# EAGLE design C64_Userport_Test_SMD (EAGLE 9.6.2)
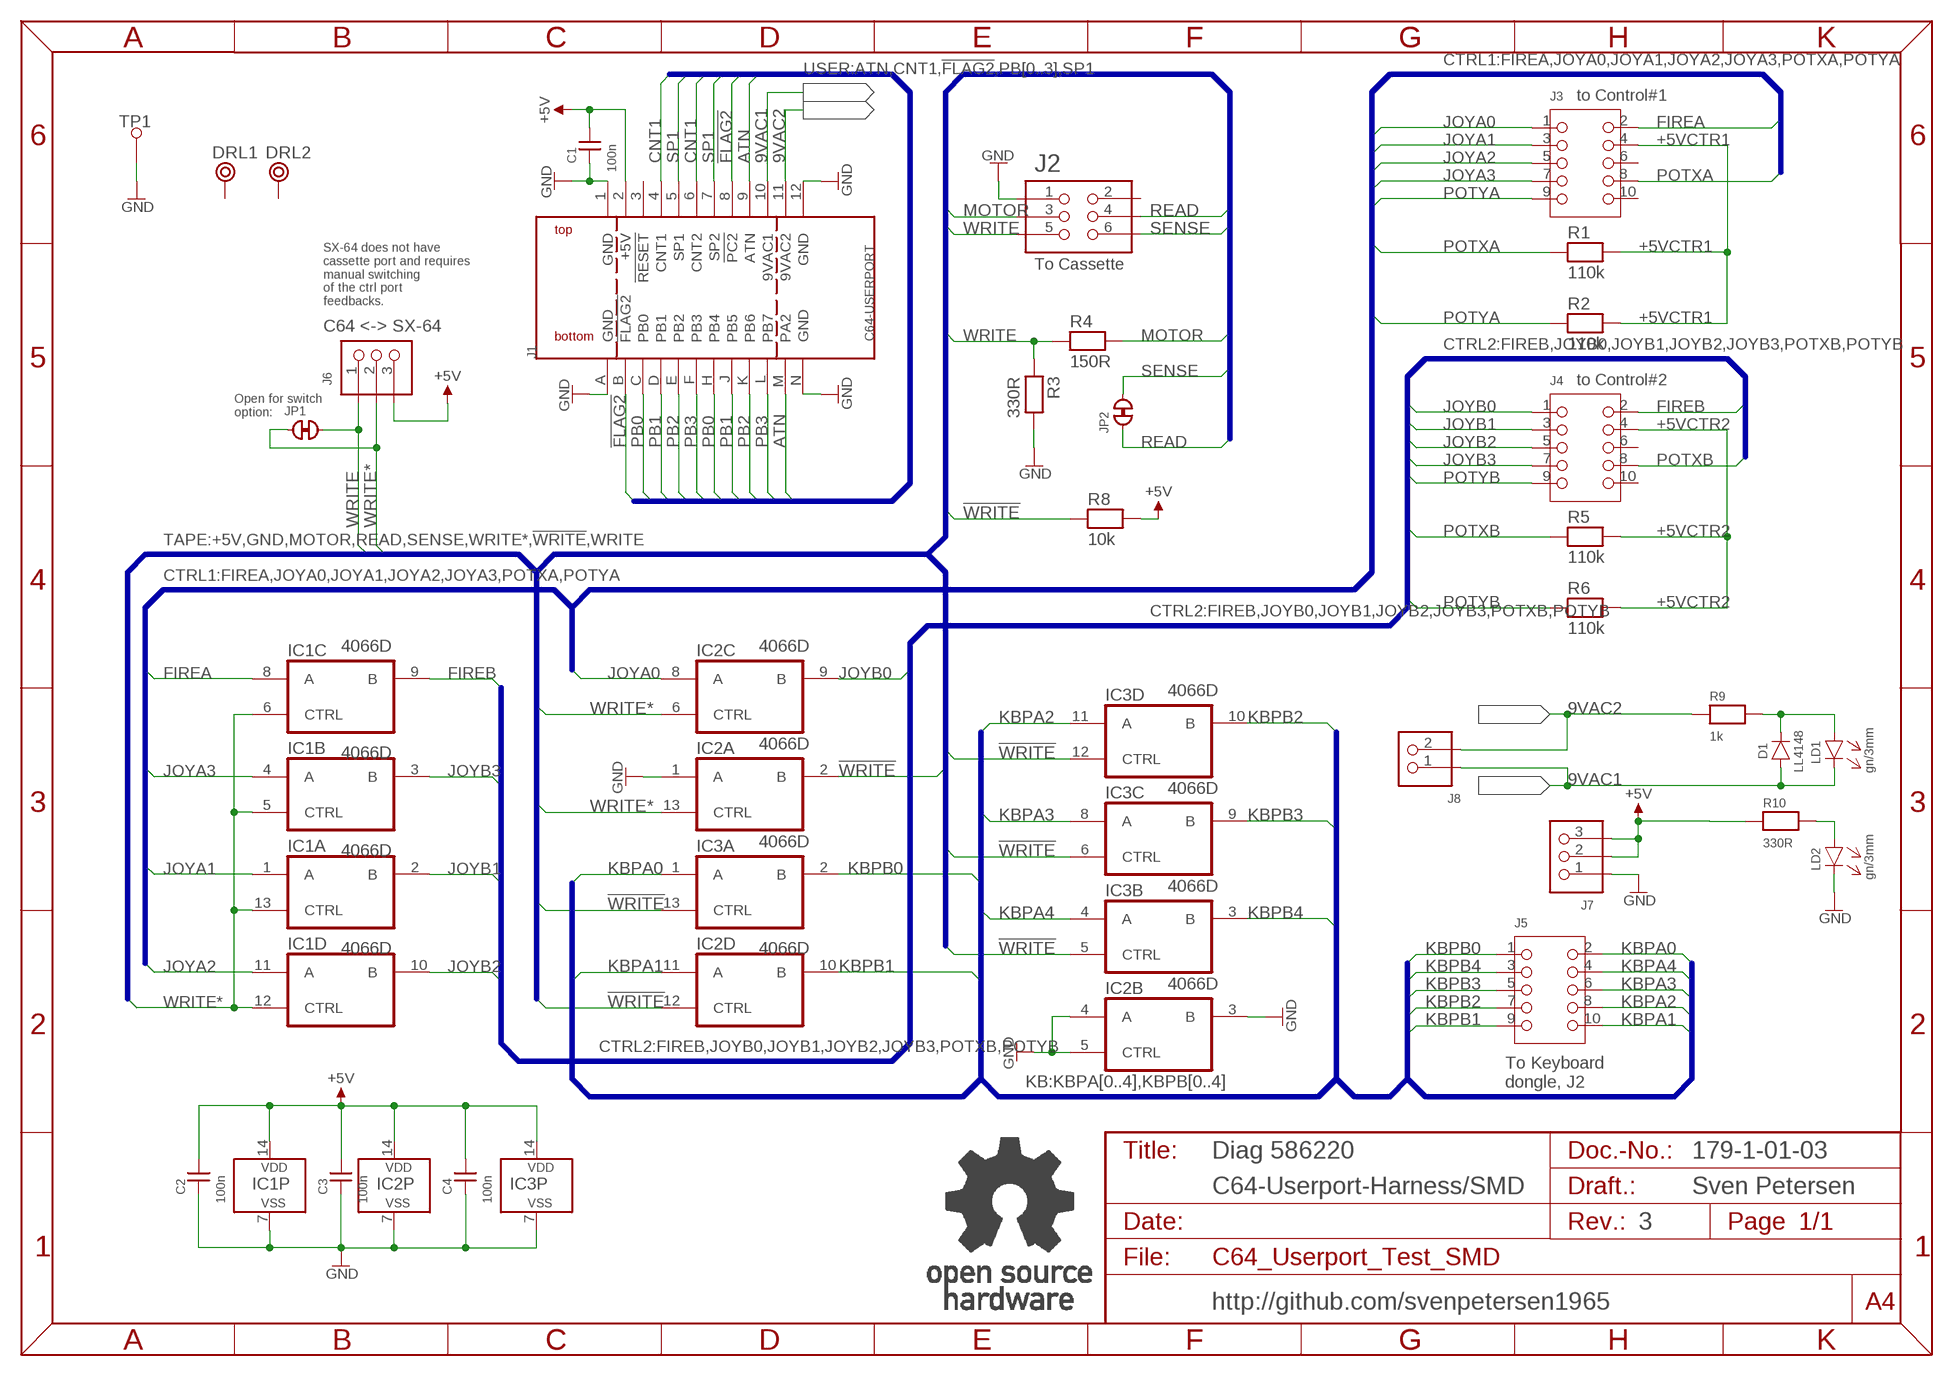
[diagram p0: schematic, sheet 1]

## Parts
C1  100n  CAP010805  [0805]
C2  100n  CAP010805  [0805]
C3  100n  CAP010805  [0805]
C4  100n  CAP010805  [0805]
D1  LL4148  [SOD80C]
DRL1  BOHR3,2  [BOHR3,2]
DRL2  BOHR3,2  [BOHR3,2]
IC1  4066D  [SO14]
IC2  4066D  [SO14]
IC3  4066D  [SO14]
J1  C64-USERPORT  [USERPORT]
J2  2X03WV  [2X03WV]
J3  2X05WV  [2X05WV]
J4  2X05WV  [2X05WV]
J5  2X05WV  [2X05WV]
J6  PINHD-1X3  [1X03]
J7  PINHD-1X3  [1X03]
J8  PINHD-1X2  [1X02]
JP1  CLOSED  [CP_CL]
JP2  CLOSED  [CP_CL]
LD1  gn/3mm  3MM  [3MM]
LD2  gn/3mm  3MM  [3MM]
R1  110k  RES040805  [0805]
R2  110k  RES040805  [0805]
R3  330R  RES040805  [0805]
R4  150R  RES040805  [0805]
R5  110k  RES040805  [0805]
R6  110k  RES040805  [0805]
R8  10k  RES040805  [0805]
R9  1k  RES040805  [0805]
R10  330R  RES040805  [0805]
TP1  L1,2_R  [1,2MM_R]
U$20  OPEN_SOURCE_HW  [OPENHW]

## Nets
9VAC1: D1.A J1.10(9VAC1) J8.1 LD1.C(K)
9VAC2: J1.11(9VAC2) J8.2 R9.1
!FLAG2: J1.8(!PC2) J1.B(!FLAG2)
!WRITE: IC2.2(A:B) IC2.12(D:CTRL) IC3.5(B:CTRL) IC3.6(C:CTRL) IC3.12(D:CTRL) IC3.13(A:CTRL) R8.1
+5V: C1.2 C2.2 C3.2 C4.2 IC1.14(P:VDD) IC2.14(P:VDD) IC3.14(P:VDD) J1.2(+5V) J6.3 J7.2 J7.3 R8.2 R10.1
+5VCTR1: J3.4 R1.2 R2.2
+5VCTR2: J4.4 R5.2 R6.2
ATN: J1.9(ATN) J1.M(PA2)
CNT1: J1.4(CNT1) J1.6(CNT2)
FIREA: IC1.8(C:A) J3.2
FIREB: IC1.9(C:B) J4.2
GND: C1.1 C2.1 C3.1 C4.1 IC1.7(P:VSS) IC2.1(A:A) IC2.3(B:B) IC2.4(B:A) IC2.5(B:CTRL) IC2.7(P:VSS) IC3.7(P:VSS) J1.1(GND) J1.12(GND) J1.A(GND) J1.N(GND) J2.1 J7.1 LD2.C(K) R3.2 TP1.1
JOYA0: IC2.8(C:A) J3.1
JOYA1: IC1.1(A:A) J3.3
JOYA2: IC1.11(D:A) J3.5
JOYA3: IC1.4(B:A) J3.7
JOYB0: IC2.9(C:B) J4.1
JOYB1: IC1.2(A:B) J4.3
JOYB2: IC1.10(D:B) J4.5
JOYB3: IC1.3(B:B) J4.7
KBPA0: IC3.1(A:A) J5.2
KBPA1: IC2.11(D:A) J5.10
KBPA2: IC3.11(D:A) J5.8
KBPA3: IC3.8(C:A) J5.6
KBPA4: IC3.4(B:A) J5.4
KBPB0: IC3.2(A:B) J5.1
KBPB1: IC2.10(D:B) J5.9
KBPB2: IC3.10(D:B) J5.7
KBPB3: IC3.9(C:B) J5.5
KBPB4: IC3.3(B:B) J5.3
MOTOR: J2.3 R4.2
N$1: D1.K LD1.A R9.2
N$3: LD2.A R10.2
PB0: J1.C(PB0) J1.H(PB4)
PB1: J1.D(PB1) J1.J(PB5)
PB2: J1.E(PB2) J1.K(PB6)
PB3: J1.F(PB3) J1.L(PB7)
POTXA: J3.8 R1.1
POTXB: J4.8 R5.1
POTYA: J3.9 R2.1
POTYB: J4.9 R6.1
READ: J2.4 JP2.1
SENSE: J2.6 JP2.2
SP1: J1.5(SP1) J1.7(SP2)
WRITE: J2.5 J6.1 JP1.2 R3.1 R4.1
WRITE*: IC1.5(B:CTRL) IC1.6(C:CTRL) IC1.12(D:CTRL) IC1.13(A:CTRL) IC2.6(C:CTRL) IC2.13(A:CTRL) J6.2 JP1.1
Unconnected: DRL1.P$1 DRL2.P$1 J1.3(!RESET) J2.2 J3.6 J3.10 J4.6 J4.10

## Buses
USER:ATN,CNT1,!FLAG2,PB[0..3],SP1
TAPE:+5V,GND,MOTOR,READ,SENSE,WRITE*,!WRITE,WRITE
CTRL1:FIREA,JOYA0,JOYA1,JOYA2,JOYA3,POTXA,POTYA
CTRL2:FIREB,JOYB0,JOYB1,JOYB2,JOYB3,POTXB,POTYB
KB:KBPA[0..4],KBPB[0..4]

## Notes on the sheet
- to Control#1
- To Cassette
- SX-64 does not have
  cassette port and requires
  manual switching
  of the ctrl port
  feedbacks.
- C64 <-> SX-64
- to Control#2
- Open for switch
  option:
- To Keyboard
  dongle, J2
- Diag 586220 | 179-1-01-03
- C64-Userport-Harness/SMD | Sven Petersen
- 3
- http://github.com/svenpetersen1965

## Library data of the parts
C1-C4 = DISCRETE:CAP01
D1 = Dioden:LL4148
DRL1 DRL2 = Mech_Bohr:BOHR3,2
IC1-IC3 = 40xx:4066: Quad bilateral ANALOG SWITCH
J1 = Commodore:C64-USERPORT
J2 = PINHEAD:2X03WV
J3-J5 = PINHEAD:2X05WV
J6 J7 = PINHEAD:PINHD-1X3
J8 = PINHEAD:PINHD-1X2
JP1 JP2 = Cutpad:CLOSED: Closed Cutpad
LD1 LD2 = LED:3MM
R1-R6 R8-R10 = DISCRETE:RES04
TP1 = Pads:L1,2_R
U$20 = Logo:OPEN_SOURCE_HW

## Board
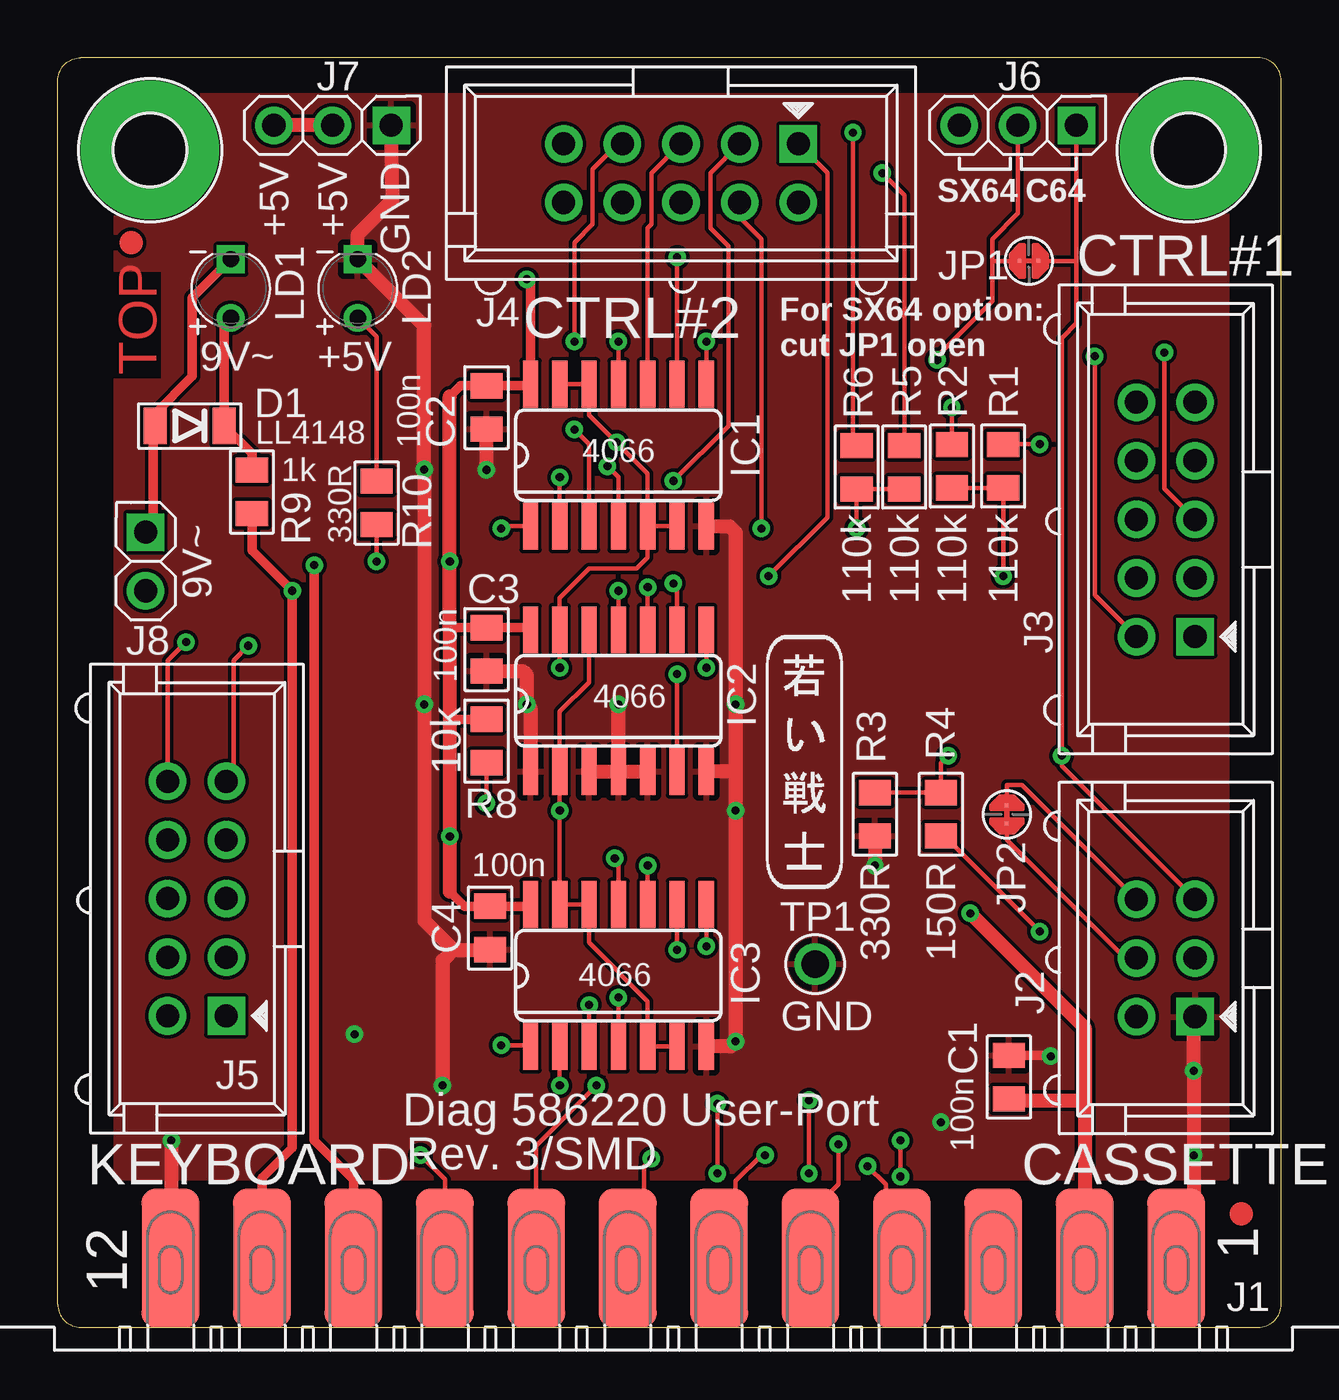
[diagram p1: board, top side]
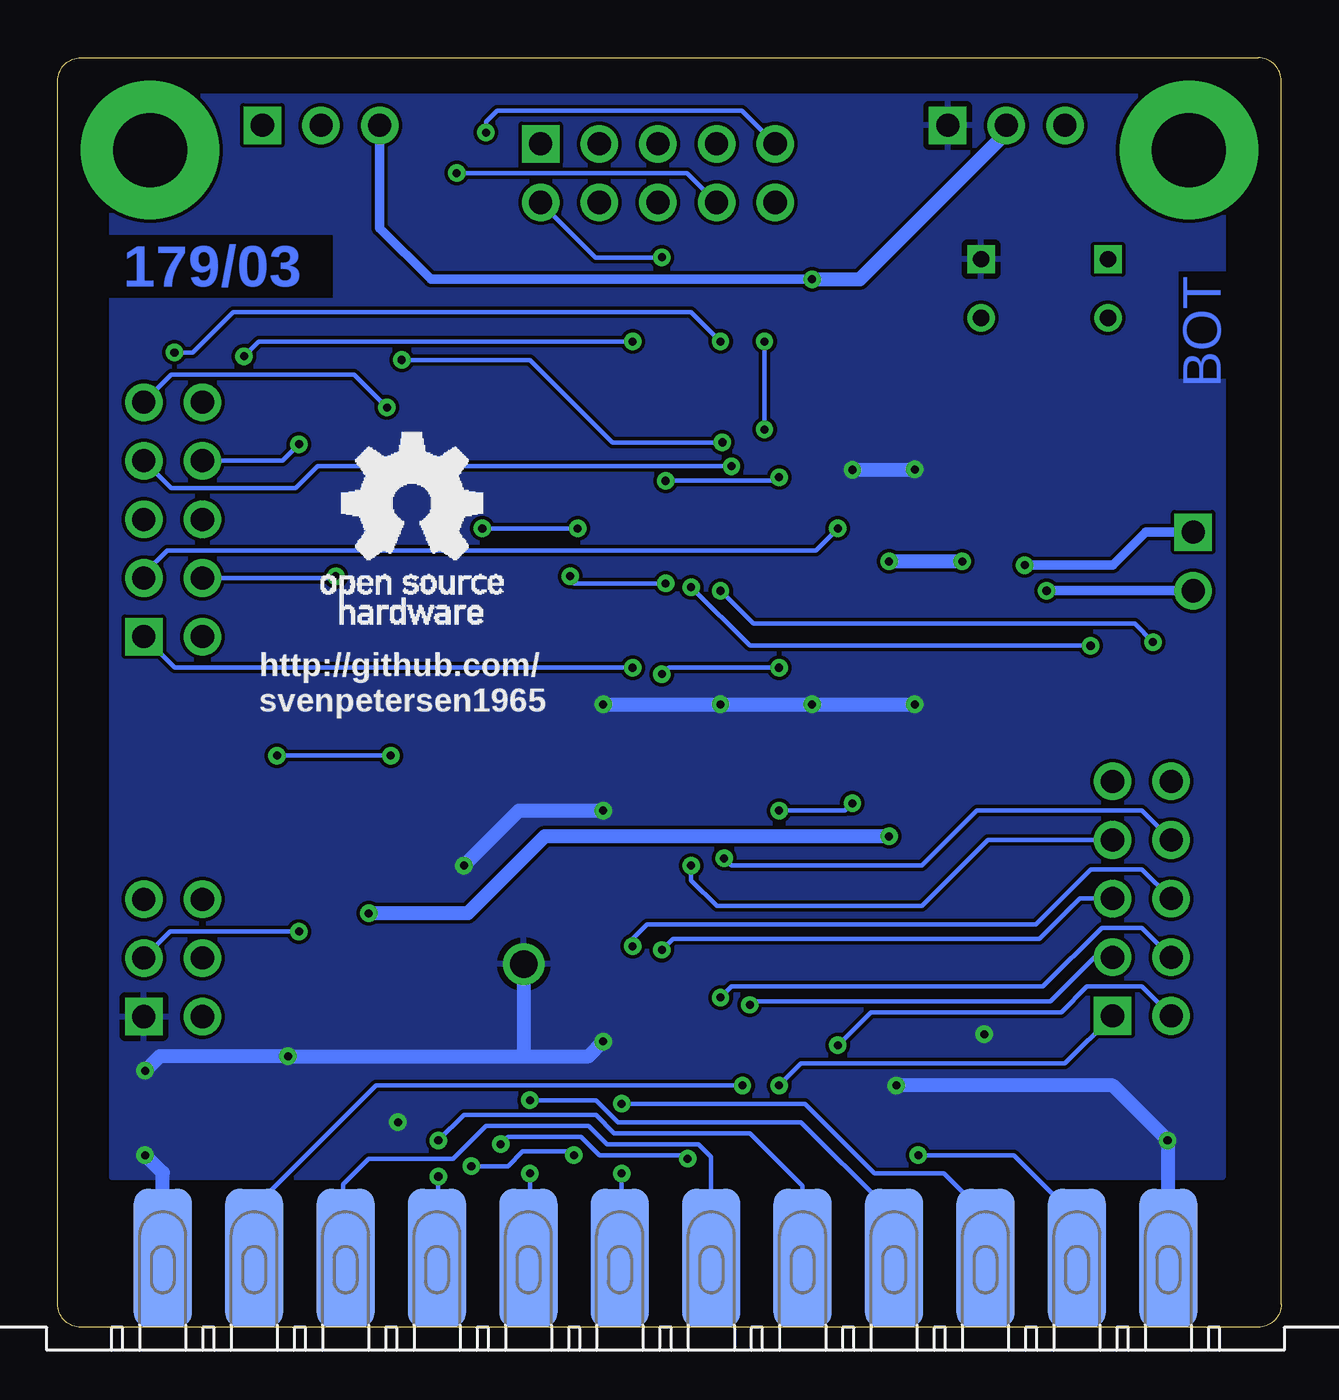
[diagram p2: board, bottom side, seen from below]

Size 53 x 55 mm. Coordinates in mm from the lower left corner, seen from the top.
Outline: 0,1 0,54 arc-90 1,55 52,55 arc-90 53,54 53,1 arc-90 52,0 1,0 arc-90 0,1
Copper layers (1*16): Top 0.035mm / dielectric 1.5mm / Bottom 0.035mm
Design rules "default *": minimum track width 6mil, minimum drill 0.35mm, track to track 6mil, track to pad 6mil, pad to pad 6mil, via to via 6mil, smd to smd 6mil, copper to edge 40mil, drill to drill 6mil, minimum pad ring 10mil, minimum via ring 8mil, stop-mask expansion 4mil, vias tented up to drill 24mil, thermal gap 10mil
bRestrict: 3 lines

### Footprints (pad centres in the part's own frame; a part is rotated, then mirrored left to right if it is on the bottom)
0805 = smd 1.092 x 1.397: 1 -0.94,0; 2 0.94,0
SOD80C = smd 1 x 1.6: A -1.5,0; K 1.5,0
BOHR3,2 = drill 3.2 pad 6: P$1 0,0
SO14 = smd 0.66 x 2.032: 1 -3.81,-3.073; 2 -2.54,-3.073; 3 -1.27,-3.073; 4 0,-3.073; 5 1.27,-3.073; 6 2.54,-3.073; 7 3.81,-3.073; 8 3.81,3.073; 9 2.54,3.073; 10 1.27,3.073; 11 0,3.073; 12 -1.27,3.073; 13 -2.54,3.073; 14 -3.81,3.073
USERPORT = smd 2.5 x 6: 1 -21.78,-3; 2 -17.82,-3; 3 -13.86,-3; 4 -9.9,-3; 5 -5.94,-3; 6 -1.98,-3; 7 1.98,-3; 8 5.94,-3; 9 9.9,-3; 10 13.86,-3; 11 17.82,-3; 12 21.78,-3 | smd 2.5 x 6 bottom: A -21.78,-3; B -17.82,-3; C -13.86,-3; D -9.9,-3; E -5.94,-3; F -1.98,-3; H 1.98,-3; J 5.94,-3; K 9.9,-3; L 13.86,-3; M 17.82,-3; N 21.78,-3
2X03WV = drill 1 pad 1.626 square: 1 -2.54,-1.27 | drill 1 pad 1.626: 2 -2.54,1.27; 3 0,-1.27; 4 0,1.27; 5 2.54,-1.27; 6 2.54,1.27
2X05WV = drill 1 pad 1.626 square: 1 -5.08,-1.27 | drill 1 pad 1.626: 2 -5.08,1.27; 3 -2.54,-1.27; 4 -2.54,1.27; 5 0,-1.27; 6 0,1.27; 7 2.54,-1.27; 8 2.54,1.27; 9 5.08,-1.27; 10 5.08,1.27
1X03 = drill 1 pad 1.626 square: 1 -2.54,0 | drill 1 pad 1.626: 2 0,0; 3 2.54,0
1X02 = drill 1 pad 1.626 square: 1 -1.27,0 | drill 1 pad 1.626: 2 1.27,0
CP_CL = smd 0.152 x 0.152: 1 -0.4,0; 2 0.4,0
3MM = drill 0.7: A -1.27,0 | drill 0.7 square: C 1.27,0
1,2MM_R = drill 1.2: 1 0,0

### Placement (x,y rotation side)
C1  41.2,10.84 270 top
C2  18.57,39.85 90 top
C3  18.57,29.37 90 top
C4  18.73,17.3 90 top
D1  5.71,39.05 0 top
DRL1  4,51 0 top
DRL2  49,51 0 top
IC1  24.29,37.78 0 top
IC2  24.29,27.15 0 top
IC3  24.29,15.24 0 top
J1  26.67,0 180 top
J2  48,16 90 top
J3  48,35 90 top
J4  27,50 180 top
J5  6.03,18.57 90 top
J6  41.59,52.07 180 top
J7  11.91,52.07 180 top
J8  3.81,33.18 270 top
JP1  42.07,46.2 0 top
JP2  41.12,22.23 90 top
LD1  7.5,45 90 top
LD2  13,45 90 top
R1  40.96,37.31 270 top
R2  38.73,37.31 270 top
R3  35.4,22.23 270 top
R4  38.26,22.23 270 top
R5  36.67,37.26 270 top
R6  34.61,37.26 270 top
R8  18.57,25.4 90 top
R9  8.41,36.2 90 top
R10  13.81,35.72 90 top
TP1  32.81,15.74 0 top
U$15  [SVEN_TAG]  32.38,24.61 0 top
U$17  [2LAYER]  4.29,41.27 90 top
U$18  [PCB-TITLE/]  0,64 0 top  (outside the outline)
U$20  41.59,30.48 0 bottom
U$21  [SMD_REF_R1MM]  3.17,46.99 0 top
U$22  [SMD_REF_R1MM]  51.28,4.92 0 top

### Tracks (layer width: path | path; a pad name or v marks a point on that pad's centre or on a via)
9VAC1  (via drill 0.35)
  Top 0.406: J1.10 12.81,6.4 11.11,8.1 v11.11,33.02 | J8.1 4.13,34.77 4.13,38.97 D1.A 4.21,39.58 5.84,41.2 5.84,44.61 LD1.C
  Bottom 0.406: v11.11,33.02 7.3,33.02 5.87,34.45 J8.1
9VAC2  (via drill 0.35)
  Top 0.406: J1.11 8.85,6.47 10.16,7.78 10.16,9.37 v10.16,31.91 8.41,33.66 R9.1
  Bottom 0.406: v10.16,31.91 J8.2
!FLAG2  (via drill 0.35)
  Top 0.203: J1.8 20.73,7.87 v23.34,10.48
  Bottom 0.203: v23.34,10.48 39.21,10.48 44.49,5.2 J1.B
!WRITE  (via drill 0.35)
  Top 0.203: IC3.6 IC3.5 25.56,14.13 23.02,16.67 IC3.12 IC3.13 v21.75,22.38 IC2.2 21.75,26.67 23.02,27.94 IC2.12 | v18.57,22.7 R8.1
  Bottom 0.203: v21.75,22.38 18.89,22.38 v18.57,22.7
+5V  (via drill 0.35)
  Top 0.203: R10.1 v13.81,33.18
  Top 0.406: v20.32,45.4 20.48,45.4 IC1.14 20.41,40.79 C2.2 17.45,40.79 16.99,40.32 | IC2.14 20.39,30.31 C3.2 17,30.31 16.99,30.32 | IC3.14 20.41,18.24 C4.2 17.62,18.24 16.99,18.88 | R8.2 17.13,26.34 16.99,26.19 | C1.2 41.26,9.84
  Top 0.61: 16.99,30.32 16.99,26.19 v16.99,21.27 16.99,18.88 | 17,30.31 16.99,30.32 | 16.99,30.32 v16.99,33.18 16.99,40.32 | v39.53,17.94 44.49,12.98 44.49,9.84 | 44.49,9.84 J1.2 | 41.26,9.84 44.49,9.84 | J7.2 J7.3
  Bottom 0.406: v20.32,45.4 35.4,45.4 36.83,45.4 39.05,47.62 J6.3
  Bottom 0.61: v16.99,21.27 31.91,21.27 35.24,17.94 v39.53,17.94 | v20.32,45.4 18.26,45.4 11.91,51.75 J7.2 | v13.81,33.18 v16.99,33.18
+5VCTR1  (via drill 0.35)
  Top 0.203: v40.96,32.54 R1.2 R2.2
  Bottom 0.203: J3.4 41.04,32.46 v40.96,32.54
+5VCTR2  (via drill 0.35)
  Top 0.203: J4.4 29.54,48.09 30.48,47.15 v30.48,34.61 | v34.61,34.61 R6.2 R5.2
  Bottom 0.203: v30.48,34.61 v34.61,34.61
ATN  (via drill 0.35)
  Top 0.203: v15.72,7.46 16.77,6.41 J1.9
  Bottom 0.203: J1.M 8.85,4.72 11.59,7.46 v15.72,7.46
CNT1  (via drill 0.35)
  Top 0.203: J1.6 28.65,3.17 29.37,3.89 29.37,6.35 30.48,7.46 v30.64,7.46 | v35.08,6.99 35.88,6.19 35.88,3.69 J1.4
  Bottom 0.203: v30.64,7.46 30.8,7.62 32.86,7.62 33.5,6.99 v35.08,6.99
FIREA  (via drill 0.35)
  Top 0.203: IC1.8 v28.1,42.7 | v44.93,42.07 44.93,31.72 J3.2
  Bottom 0.203: v28.1,42.7 44.29,42.7 v44.93,42.07
FIREB  (via drill 0.35)
  Top 0.203: v26.83,46.35 IC1.9
  Bottom 0.203: J4.2 29.7,46.35 26.84,46.35 v26.84,46.35 v26.83,46.35
GND  (via drill 0.35)
  Top 0.406: C1.1 42.99,11.78 v43.02,11.75 | 49.21,13.4 J2.1 | 49.21,3.76 J1.A
  Top 0.61: IC1.7 29.11,34.71 29.37,34.45 v29.37,26.99 29.37,25.88 29.37,24.13 | 29.37,24.13 29.31,24.07 IC2.7 | IC2.1 20.48,26.83 v20.32,26.99 20.32,28.26 20.15,28.43 C3.1 | IC2.3 IC2.4 | IC2.4 IC2.5 | IC2.4 v24.29,26.99 | 29.37,24.13 v29.37,22.38 v29.37,12.38 29.15,12.17 IC3.7 | 17.14,16.35 15.88,17.62 v15.88,26.99 v15.88,37.16 15.88,43.4 LD2.C 13,47.34 14.5,48.84 J7.1 | 17.14,16.35 C4.1 | 17.14,16.35 16.67,15.88 v16.67,10.48 | v18.57,37.15 C2.1 | 49.21,13.4 v49.21,11.11 v49.21,7.46 49.21,3.76 | R3.2 v35.4,20 | v4.92,8.1 4.92,3.03 J1.12
  Bottom 0.61: v29.37,26.99 v24.29,26.99 v20.32,26.99 v15.88,26.99 | v15.88,37.16 15.89,37.15 v18.57,37.15 | v49.21,11.11 48.58,11.75 v43.02,11.75 32.86,11.75 | 32.86,11.75 30,11.75 v29.37,12.38 | v35.4,20 33.02,22.38 v29.37,22.38 | J1.12 4.89,8.06 v4.92,8.1 7.3,10.48 v16.67,10.48 | J1.A 48.45,6.7 v49.21,7.46 | TP1.1 32.81,11.8 32.86,11.75
  other vias: 12.86,12.7 38.26,8.89
  pour Top: 2.54,6.51 50.64,6.51 50.64,53.34 2.54,53.34
  pour Bottom: 2.54,6.51 50.64,6.51 50.64,53.34 2.54,53.34
JOYA0  (via drill 0.35)
  Top 0.203: IC2.8 v28.1,28.57
  Bottom 0.203: v28.1,28.57 47.92,28.57 J3.1
JOYA1  (via drill 0.35)
  Top 0.203: IC1.1 19.31,34.71 v19.21,34.61
  Bottom 0.203: J3.3 49.27,32.65 48.26,33.66 20.16,33.66 v19.21,34.61
JOYA2  (via drill 0.35)
  Top 0.203: IC1.11 v24.29,42.7 | v47.94,42.23 47.94,36.33 J3.5
  Bottom 0.203: v47.94,42.23 47.15,42.23 45.4,43.97 25.56,43.97 v24.29,42.7
JOYA3  (via drill 0.35)
  Top 0.203: v23.81,37.31 24.29,36.83 IC1.4
  Bottom 0.203: J3.7 48.08,36.35 42.7,36.35 41.75,37.31 v23.81,37.31
JOYB0  (via drill 0.35)
  Top 0.203: J4.1 33.34,50.01 33.34,35.08 v30.8,32.54 | v26.67,32.23 26.83,32.07 IC2.9
  Bottom 0.203: v30.8,32.54 30.8,32.38 30.64,32.23 v26.67,32.23
JOYB1  (via drill 0.35)
  Top 0.203: J4.3 28.27,50 28.27,47.61 29.05,46.83 29.05,39.05 v26.67,36.67 | v21.75,36.83 IC1.2
  Bottom 0.203: v26.67,36.67 21.91,36.67 v21.75,36.83
JOYB2
  Top 0.203: IC1.10 25.56,47.62 25.72,47.78 25.72,50.01 26.98,51.27 J4.5
JOYB3  (via drill 0.35)
  Top 0.203: IC1.3 23.02,38.26 v22.38,38.89 | v22.38,42.7 22.38,46.99 23.18,47.78 23.18,50.16 24.28,51.27 J4.7
  Bottom 0.203: v22.38,38.89 v22.38,42.7
KBPA0  (via drill 0.35)
  Top 0.203: v19.21,12.22 20.42,12.22 IC3.1
  Bottom 0.203: J5.2 6.03,14.76 8.41,14.76 9.53,13.65 17.78,13.65 v19.21,12.22
KBPA1  (via drill 0.35)
  Top 0.203: J5.10 4.76,28.89 v5.56,29.69 | v24.29,31.91 IC2.11
  Bottom 0.203: v24.29,31.91 22.86,30.48 6.35,30.48 v5.56,29.69
KBPA2  (via drill 0.35)
  Top 0.203: v24.13,20.32 24.29,20.16 IC3.11
  Bottom 0.203: J5.8 6.03,22.38 13.18,22.38 15.56,20 23.81,20 v24.13,20.32
KBPA3  (via drill 0.35)
  Top 0.203: v28.1,16.51 IC3.8
  Bottom 0.203: J5.6 6.03,19.84 8.26,19.84 10.64,17.46 27.46,17.46 28.1,16.83 v28.1,16.51
KBPA4  (via drill 0.35)
  Top 0.203: v24.29,14.29 IC3.4
  Bottom 0.203: J5.4 6.03,17.3 7.78,17.3 10.32,14.76 22.38,14.76 23.81,14.76 v24.29,14.29
KBPB0  (via drill 0.35)
  Top 0.203: v21.75,10.48 IC3.2
  Bottom 0.203: J5.1 9.37,11.43 20.8,11.43 v21.75,10.48
KBPB1  (via drill 0.35)
  Top 0.203: J5.9 7.62,23.97 7.62,28.89 v8.26,29.53 | v25.56,32.07 IC2.10
  Bottom 0.203: v25.56,32.07 23.02,29.53 v8.26,29.53
KBPB2  (via drill 0.35)
  Top 0.203: v25.56,20 IC3.10
  Bottom 0.203: J5.7 12.7,21.11 15.56,18.26 24.45,18.26 25.56,19.37 v25.56,20
KBPB3  (via drill 0.35)
  Top 0.203: v26.83,16.35 IC3.9
  Bottom 0.203: v26.83,16.35 26.35,16.83 10.48,16.83 8.73,18.57 J5.5
KBPB4  (via drill 0.35)
  Top 0.203: v23.02,13.97 IC3.3
  Bottom 0.203: J5.3 8.1,16.03 10,14.13 22.86,14.13 v23.02,13.97
MOTOR  (via drill 0.35)
  Top 0.203: v42.55,17.14 38.41,21.29 R4.2
  Bottom 0.203: J2.3 48.12,17.14 v42.55,17.14
N$1
  Top 0.406: R9.2 8.41,37.85 D1.K 7.21,43.45 LD1.A
N$3
  Top 0.203: LD2.A 13.81,42.92 R10.2
PB0
  Bottom 0.203: J1.H 24.69,7.39 25.24,7.94 29.21,7.94 30,8.73 34.45,8.73 35.88,7.3 39.53,7.3 40.64,6.19 40.64,3.11 J1.C
PB1  (via drill 0.35)
  Top 0.203: v36.51,8.1 v36.51,6.53 | v36.51,6.53 36.51,6.51 v36.51,6.53
  Bottom 0.203: J1.J 20.73,6.12 23.02,8.41 28.89,8.41 29.69,9.21 33.66,9.21 35.4,9.21 v36.51,8.1 | v36.51,6.53 36.51,3.06 J1.D
PB2  (via drill 0.35)
  Top 0.203: v32.54,9.84 v32.54,6.67
  Bottom 0.203: J1.K 17.14,3.38 17.14,5.24 20.8,8.89 28.73,8.89 29.69,9.84 v32.54,9.84 | v32.54,6.67 32.54,3.07 J1.E
PB3  (via drill 0.35)
  Top 0.203: v28.57,9.68 v28.57,6.67
  Bottom 0.203: J1.L 12.81,4.87 14.61,6.67 17.62,6.67 20.64,9.68 v28.57,9.68 | v28.57,6.67 28.57,3.08 J1.F
POTXA  (via drill 0.35)
  Top 0.203: v42.55,38.26 R1.1
  Bottom 0.203: J3.8 43.26,37.54 v42.55,38.26
POTXB  (via drill 0.35)
  Top 0.203: v35.72,50.01 36.67,49.05 R5.1
  Bottom 0.203: J4.8 25.74,50.01 v35.72,50.01
POTYA  (via drill 0.35)
  Top 0.203: v38.73,39.85 R2.1
  Bottom 0.203: J3.9 48.08,41.27 40.16,41.27 v38.73,39.85
POTYB  (via drill 0.35)
  Top 0.203: v34.45,51.75 34.45,38.36 R6.1
  Bottom 0.203: J4.9 23.36,52.7 33.97,52.7 34.45,52.23 v34.45,51.75
READ
  Top 0.203: JP2.1 41.12,21.11 46.23,16 J2.4
SENSE
  Top 0.203: J2.6 41.77,23.5 41.12,23.5 JP2.2
SP1  (via drill 0.35)
  Top 0.203: J1.7 25.4,3.71 25.4,6.99 v25.72,7.3 | v33.81,7.94 33.81,6.19 32.54,4.92 32.54,3.07 J1.5
  Bottom 0.203: v25.72,7.3 25.88,7.46 29.53,7.46 30.32,8.26 33.5,8.26 v33.81,7.94
WRITE  (via drill 0.35)
  Top 0.203: J6.1 44.13,46.2 | JP1.2 44.13,46.2 | 44.13,46.2 44.13,43.5 43.5,42.86 v43.5,24.77 43.5,24.31 J2.5 | v38.58,24.77 38.26,24.45 38.26,23.34 | 38.26,23.34 R4.1 | R3.1 38.09,23.16 38.26,23.34
  Bottom 0.203: v43.5,24.77 v38.58,24.77
WRITE*  (via drill 0.35)
  Top 0.203: IC1.13 IC1.12 23.02,39.53 v24.21,38.34 25.56,36.99 IC1.5 | IC1.5 IC1.6 | J6.2 41.59,48.26 40.48,47.15 40.48,46.2 | 40.48,46.2 40.48,44.45 38.1,42.07 v38.1,41.91 | JP1.1 40.48,46.2 | v26.83,28.3 IC2.6 | v21.75,28.57 IC2.13 21.75,31.59 23.02,32.86 25.08,32.86 25.56,33.34 IC1.5
  Bottom 0.203: v24.21,38.34 28.97,38.34 32.54,41.91 v38.1,41.91 | v21.75,28.57 26.51,28.57 26.79,28.3 v26.83,28.3

### Text on the board
Bottom: 179/03
tPlace: +5V | +5V | GND | SX64 | C64 | CTRL#1 | CTRL#2 | For SX64 option: / cut JP1 open | 9V~ | +5V | LL4148 | 1k | 330R | 9V~ | GND | Diag 586220 User-Port | Rev. 3/SMD | KEYBOARD | CASSETTE | 1 | 12
bPlace: http://github.com/ / svenpetersen1965
tNames: 100n | 4066 | 110k | 110k | 110k | 110k | 100n | 4066 | 10k | 100n | 330R | 150R | 4066 | 100n
Document: 179-2-01-03 | Diag 586220 / Harness 2022 | 35µm | 2 | 3